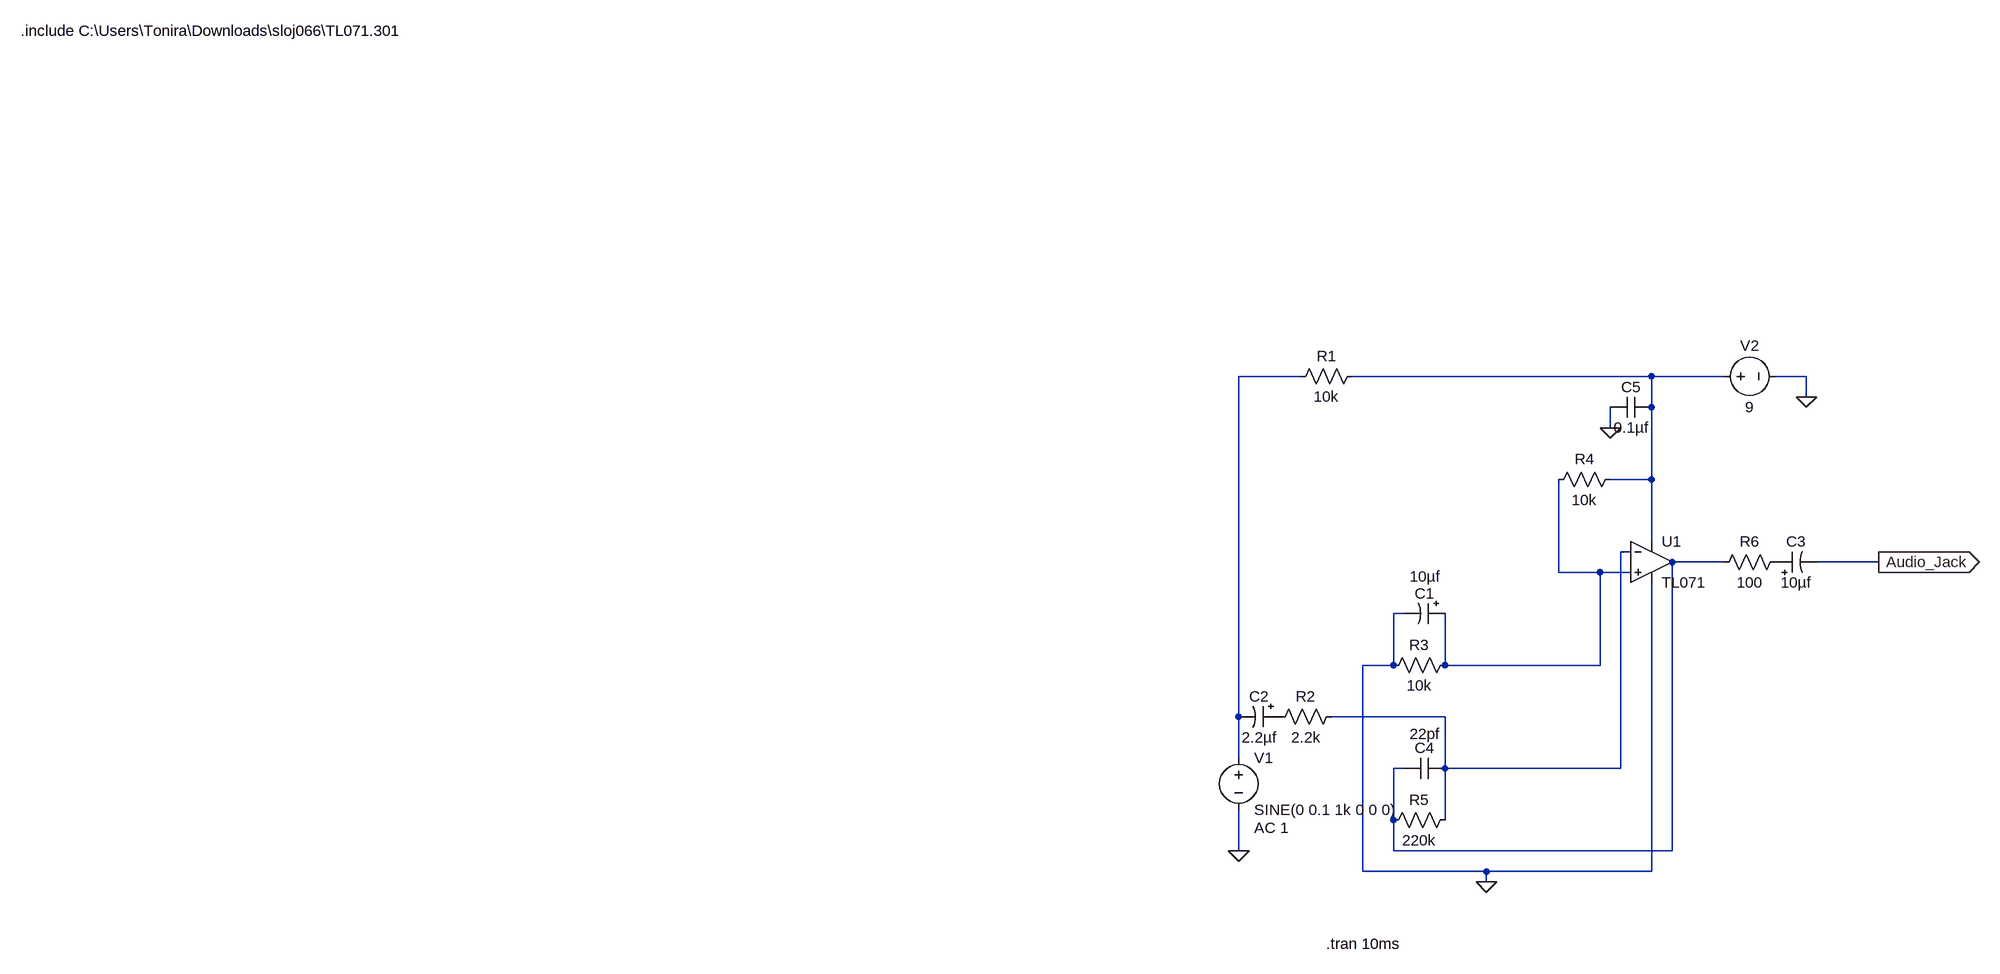
[diagram p0: schematic Draft1.asc]
Draft1.asc, the LTspice schematic file:
Version 4.1
SHEET 1 1152 680
WIRE 64 -256 -32 -256
WIRE 608 -256 144 -256
WIRE 720 -256 608 -256
WIRE 848 -256 800 -256
WIRE 848 -224 848 -256
WIRE 608 -208 608 -256
WIRE 544 -176 544 -208
WIRE 608 -96 608 -208
WIRE 608 -96 544 -96
WIRE 608 0 608 -96
WIRE 576 16 560 16
WIRE 720 32 640 32
WIRE 960 32 864 32
WIRE 464 48 464 -96
WIRE 528 48 464 48
WIRE 576 48 528 48
WIRE 224 112 208 112
WIRE 208 192 208 112
WIRE 208 192 160 192
WIRE 288 192 288 112
WIRE 528 192 528 48
WIRE 528 192 288 192
WIRE -32 272 -32 -256
WIRE 288 272 112 272
WIRE -32 336 -32 272
WIRE 224 352 208 352
WIRE 288 352 288 272
WIRE 560 352 560 16
WIRE 560 352 288 352
WIRE 208 432 208 352
WIRE 288 432 288 352
WIRE -32 480 -32 416
WIRE 208 480 208 432
WIRE 640 480 640 32
WIRE 640 480 208 480
WIRE 160 512 160 192
WIRE 352 512 160 512
WIRE 608 512 608 64
WIRE 608 512 352 512
WIRE 352 528 352 512
FLAG 352 528 0
FLAG 544 -176 0
FLAG -32 480 0
FLAG 848 -224 0
FLAG 960 32 Audio_Jack
IOPIN 960 32 Out
SYMBOL res 160 -272 R90
WINDOW 0 0 56 VBottom 2
WINDOW 3 32 56 VTop 2
SYMATTR InstName R1
SYMATTR Value 10k
SYMBOL res 128 256 R90
WINDOW 0 0 56 VBottom 2
WINDOW 3 32 56 VTop 2
SYMATTR InstName R2
SYMATTR Value 2.2k
SYMBOL res 304 176 R90
WINDOW 0 0 56 VBottom 2
WINDOW 3 32 56 VTop 2
SYMATTR InstName R3
SYMATTR Value 10k
SYMBOL res 560 -112 R90
WINDOW 0 0 56 VBottom 2
WINDOW 3 32 56 VTop 2
SYMATTR InstName R4
SYMATTR Value 10k
SYMBOL res 304 416 R90
WINDOW 0 0 56 VBottom 2
WINDOW 3 32 56 VTop 2
SYMATTR InstName R5
SYMATTR Value 220k
SYMBOL res 816 16 R90
WINDOW 0 0 56 VBottom 2
WINDOW 3 32 56 VTop 2
SYMATTR InstName R6
SYMATTR Value 100
SYMBOL polcap 288 96 R90
WINDOW 0 0 32 VBottom 2
WINDOW 3 -57 31 VTop 2
SYMATTR InstName C1
SYMATTR Value 10µf
SYMBOL polcap 32 256 R90
WINDOW 0 0 32 VBottom 2
WINDOW 3 32 32 VTop 2
SYMATTR InstName C2
SYMATTR Value 2.2µf
SYMBOL polcap 800 48 R270
WINDOW 0 32 32 VTop 2
WINDOW 3 0 32 VBottom 2
SYMATTR InstName C3
SYMATTR Value 10µf
SYMBOL cap 288 336 R90
WINDOW 0 0 32 VBottom 2
WINDOW 3 -53 31 VTop 2
SYMATTR InstName C4
SYMATTR Value 22pf
SYMBOL OpAmps\\opamp2 608 -32 R0
SYMATTR InstName U1
SYMATTR Value TL071
SYMBOL cap 608 -224 R90
WINDOW 0 0 32 VBottom 2
WINDOW 3 32 32 VTop 2
SYMATTR InstName C5
SYMATTR Value 0.1µf
SYMBOL voltage -32 320 R0
WINDOW 123 24 124 Left 2
WINDOW 39 0 0 Left 0
SYMATTR InstName V1
SYMATTR Value SINE(0 0.1 1k 0 0 0)
SYMATTR Value2 AC 1
SYMBOL voltage 704 -256 R270
WINDOW 0 32 56 VTop 2
WINDOW 3 -32 56 VBottom 2
WINDOW 123 0 0 Left 0
WINDOW 39 0 0 Left 0
SYMATTR InstName V2
SYMATTR Value 9
TEXT -1920 -792 Left 2 !.include C:\\Users\\Tonira\\Downloads\\sloj066\\TL071.301
TEXT 104 624 Left 2 !.tran 10ms

The netlist it stands for:
* Draft1.asc
R1 N002 N001 10k
R2 N003 P001 2.2k
R3 N005 0 10k
R4 N002 N005 10k
R5 N003 N004 220k
R6 P002 N004 100
C1 N005 0 10µf
C2 P001 N001 2.2µf
C3 P002 Audio_Jack 10µf
C4 N003 N004 22pf
X§U1 N005 N003 N002 0 N004 TL071  ; pins In+ In- V+ V- OUT
C5 N002 0 0.1µf
V1 N001 0 SINE(0 0.1 1k 0 0 0) AC 1
V2 N002 0 9
.include C:\Users\Tonira\Downloads\sloj066\TL071.301
.tran 10ms
.backanno
.end